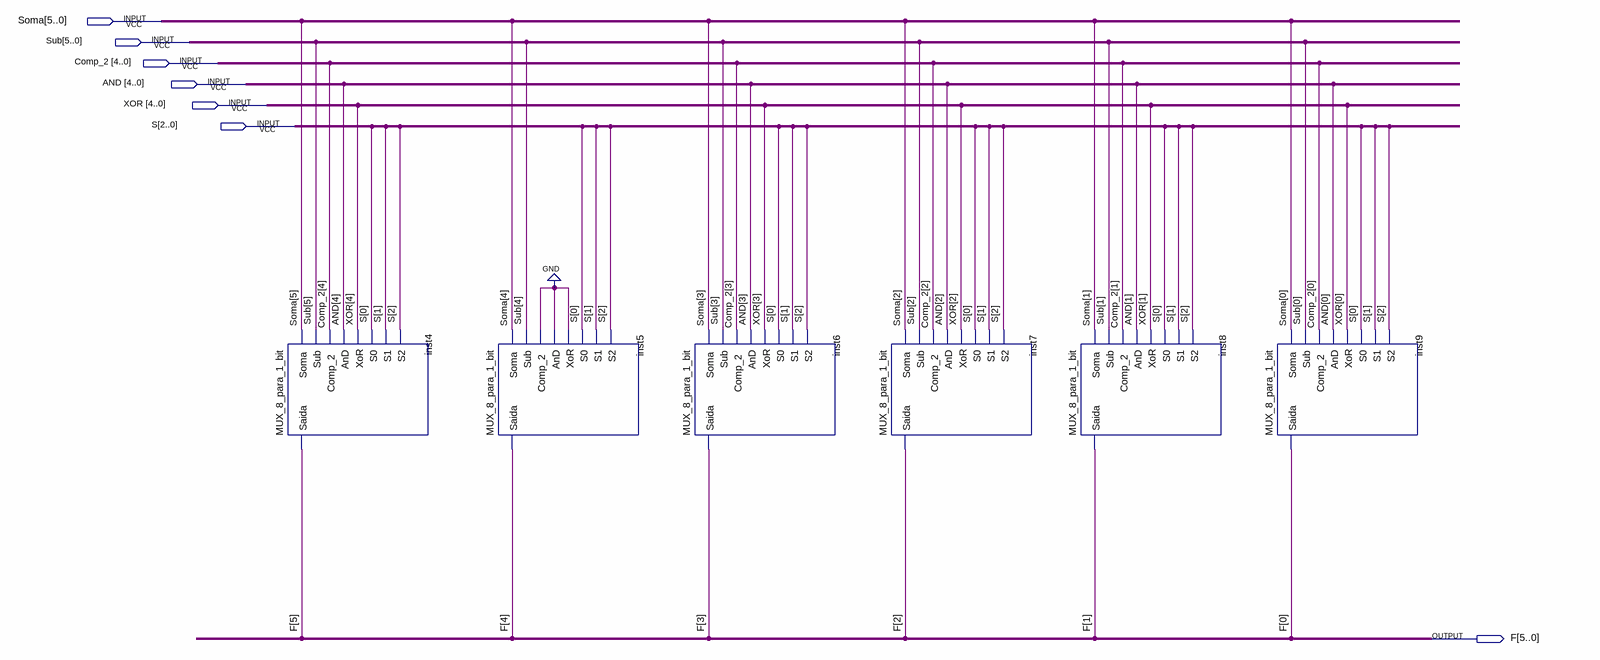
[diagram p0: schematic sheet]
// Quartus schematic MUX_8x1_6bits.bdf as structural Verilog: 6 symbols, 7 pins
module MUX_8x1_6bits (
  input  [5:0] Soma,
  input  [5:0] Sub,
  input  [4:0] Comp_2,
  input  [4:0] AND,
  input  [4:0] XOR,
  input  [2:0] S,
  output [5:0] F
);

  MUX_8_para_1_bit inst4 (
    .Soma(Soma[5]), .Sub(Sub[5]), .Comp_2(Comp_2[4]), .AnD(AND[4]), .XoR(XOR[4]), .S0(S[0]), .S1(S[1]),
    .S2(S[2]), .Saida(F[5]));
  MUX_8_para_1_bit inst5 (
    .Soma(Soma[4]), .Sub(Sub[4]), .Comp_2(1'b0), .AnD(1'b0), .XoR(1'b0), .S0(S[0]), .S1(S[1]), .S2(S[2]),
    .Saida(F[4]));
  MUX_8_para_1_bit inst6 (
    .Soma(Soma[3]), .Sub(Sub[3]), .Comp_2(Comp_2[3]), .AnD(AND[3]), .XoR(XOR[3]), .S0(S[0]), .S1(S[1]),
    .S2(S[2]), .Saida(F[3]));
  MUX_8_para_1_bit inst7 (
    .Soma(Soma[2]), .Sub(Sub[2]), .Comp_2(Comp_2[2]), .AnD(AND[2]), .XoR(XOR[2]), .S0(S[0]), .S1(S[1]),
    .S2(S[2]), .Saida(F[2]));
  MUX_8_para_1_bit inst8 (
    .Soma(Soma[1]), .Sub(Sub[1]), .Comp_2(Comp_2[1]), .AnD(AND[1]), .XoR(XOR[1]), .S0(S[0]), .S1(S[1]),
    .S2(S[2]), .Saida(F[1]));
  MUX_8_para_1_bit inst9 (
    .Soma(Soma[0]), .Sub(Sub[0]), .Comp_2(Comp_2[0]), .AnD(AND[0]), .XoR(XOR[0]), .S0(S[0]), .S1(S[1]),
    .S2(S[2]), .Saida(F[0]));
endmodule
